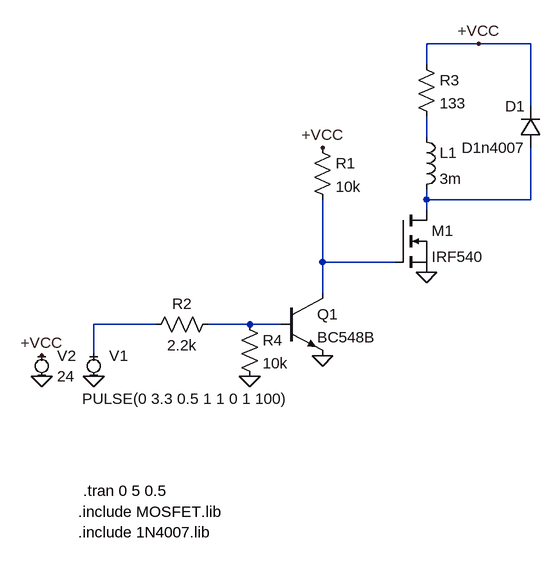
[diagram p0: schematic driveDC.asc]
driveDC.asc, the LTspice schematic file:
Version 4
SHEET 1 880 680
WIRE 384 -256 304 -256
WIRE 464 -256 384 -256
WIRE 304 -224 304 -256
WIRE 464 -160 464 -256
WIRE 304 -112 304 -144
WIRE 304 -16 304 -32
WIRE 464 -16 464 -96
WIRE 464 -16 304 -16
WIRE 304 0 304 -16
WIRE 144 80 144 -16
WIRE 256 80 144 80
WIRE 144 128 144 80
WIRE -112 176 -208 176
WIRE 32 176 -32 176
WIRE 80 176 32 176
WIRE -208 224 -208 176
FLAG 144 224 0
FLAG 304 96 0
FLAG -288 256 0
FLAG -208 256 0
FLAG -288 224 +VCC
FLAG 384 -256 +VCC
FLAG 144 -96 +VCC
FLAG 32 256 0
SYMBOL npn 80 128 R0
SYMATTR InstName Q1
SYMATTR Value BC548B
SYMBOL res 128 -112 R0
SYMATTR InstName R1
SYMATTR Value 10k
SYMATTR SpiceLine tol=5
SYMBOL res -16 160 R90
WINDOW 0 0 56 VBottom 2
WINDOW 3 32 56 VTop 2
SYMATTR InstName R2
SYMATTR Value 2.2k
SYMATTR SpiceLine tol=5
SYMBOL ind 288 -128 R0
SYMATTR InstName L1
SYMATTR Value 3m
SYMBOL res 288 -240 R0
SYMATTR InstName R3
SYMATTR Value 133
SYMBOL diode 480 -96 R180
WINDOW 0 24 64 Left 2
WINDOW 3 24 0 Left 2
SYMATTR InstName D1
SYMATTR Value D1n4007
SYMBOL MiniSyms4\\voltage- -208 240 R0
WINDOW 123 0 0 Left 2
WINDOW 39 0 0 Left 2
WINDOW 3 -18 50 Left 2
SYMATTR Value PULSE(0 3.3 0.5 1 1 0 1 100)
SYMATTR InstName V1
SYMBOL MiniSyms4\\voltage- -288 240 R0
WINDOW 123 0 0 Left 2
WINDOW 39 0 0 Left 2
SYMATTR InstName V2
SYMATTR Value 24
SYMBOL nmos 256 0 R0
SYMATTR InstName M1
SYMATTR Value IRF540
SYMBOL res 16 160 R0
SYMATTR InstName R4
SYMATTR Value 10k
SYMATTR SpiceLine tol=5
TEXT -224 432 Left 2 !.tran 0 5 0.5
TEXT -232 464 Left 2 !.include MOSFET.lib
TEXT -232 496 Left 2 !.include 1N4007.lib

The netlist it stands for:
* driveDC.asc
Q1 N003 N005 0 0 BC548B
R1 +VCC N003 10k tol=5
R2 N005 N004 2.2k tol=5
L1 N001 N002 3m
R3 +VCC N001 133
D1 N002 +VCC D1n4007
V1 N004 0 PULSE(0 3.3 0.5 1 1 0 1 100)
V2 +VCC 0 24
M1 N002 N003 0 0 IRF540
R4 N005 0 10k tol=5
.model D D
.lib standard.dio
.model NPN NPN
.model PNP PNP
.lib standard.bjt
.model NMOS NMOS
.model PMOS PMOS
.lib standard.mos
.tran 0 5 0.5
.include MOSFET.lib
.include 1N4007.lib
.backanno
.end